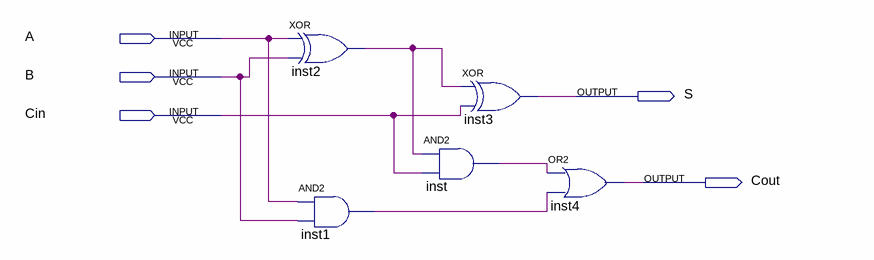
[diagram p0: schematic sheet]
// Quartus schematic fulladder.bdf as structural Verilog: 5 symbols, 5 pins
module fulladder (
  input  A,
  input  B,
  input  Cin,
  output S,
  output Cout
);

  wire inst1_out, inst2_out, inst_out;

  xor inst2 (inst2_out, A, B);
  and inst1 (inst1_out, A, B);
  and inst (inst_out, inst2_out, Cin);
  xor inst3 (S, inst2_out, Cin);
  or inst4 (Cout, inst_out, inst1_out);
endmodule
